# EasyEDA schematic SCH_t4_MFA_LCD_2021-12-15.json
TITLE: LCD Driver; REV: 1.0; Date: 2021-07-19; Sheet: 1/1; Drawn By: TCA965
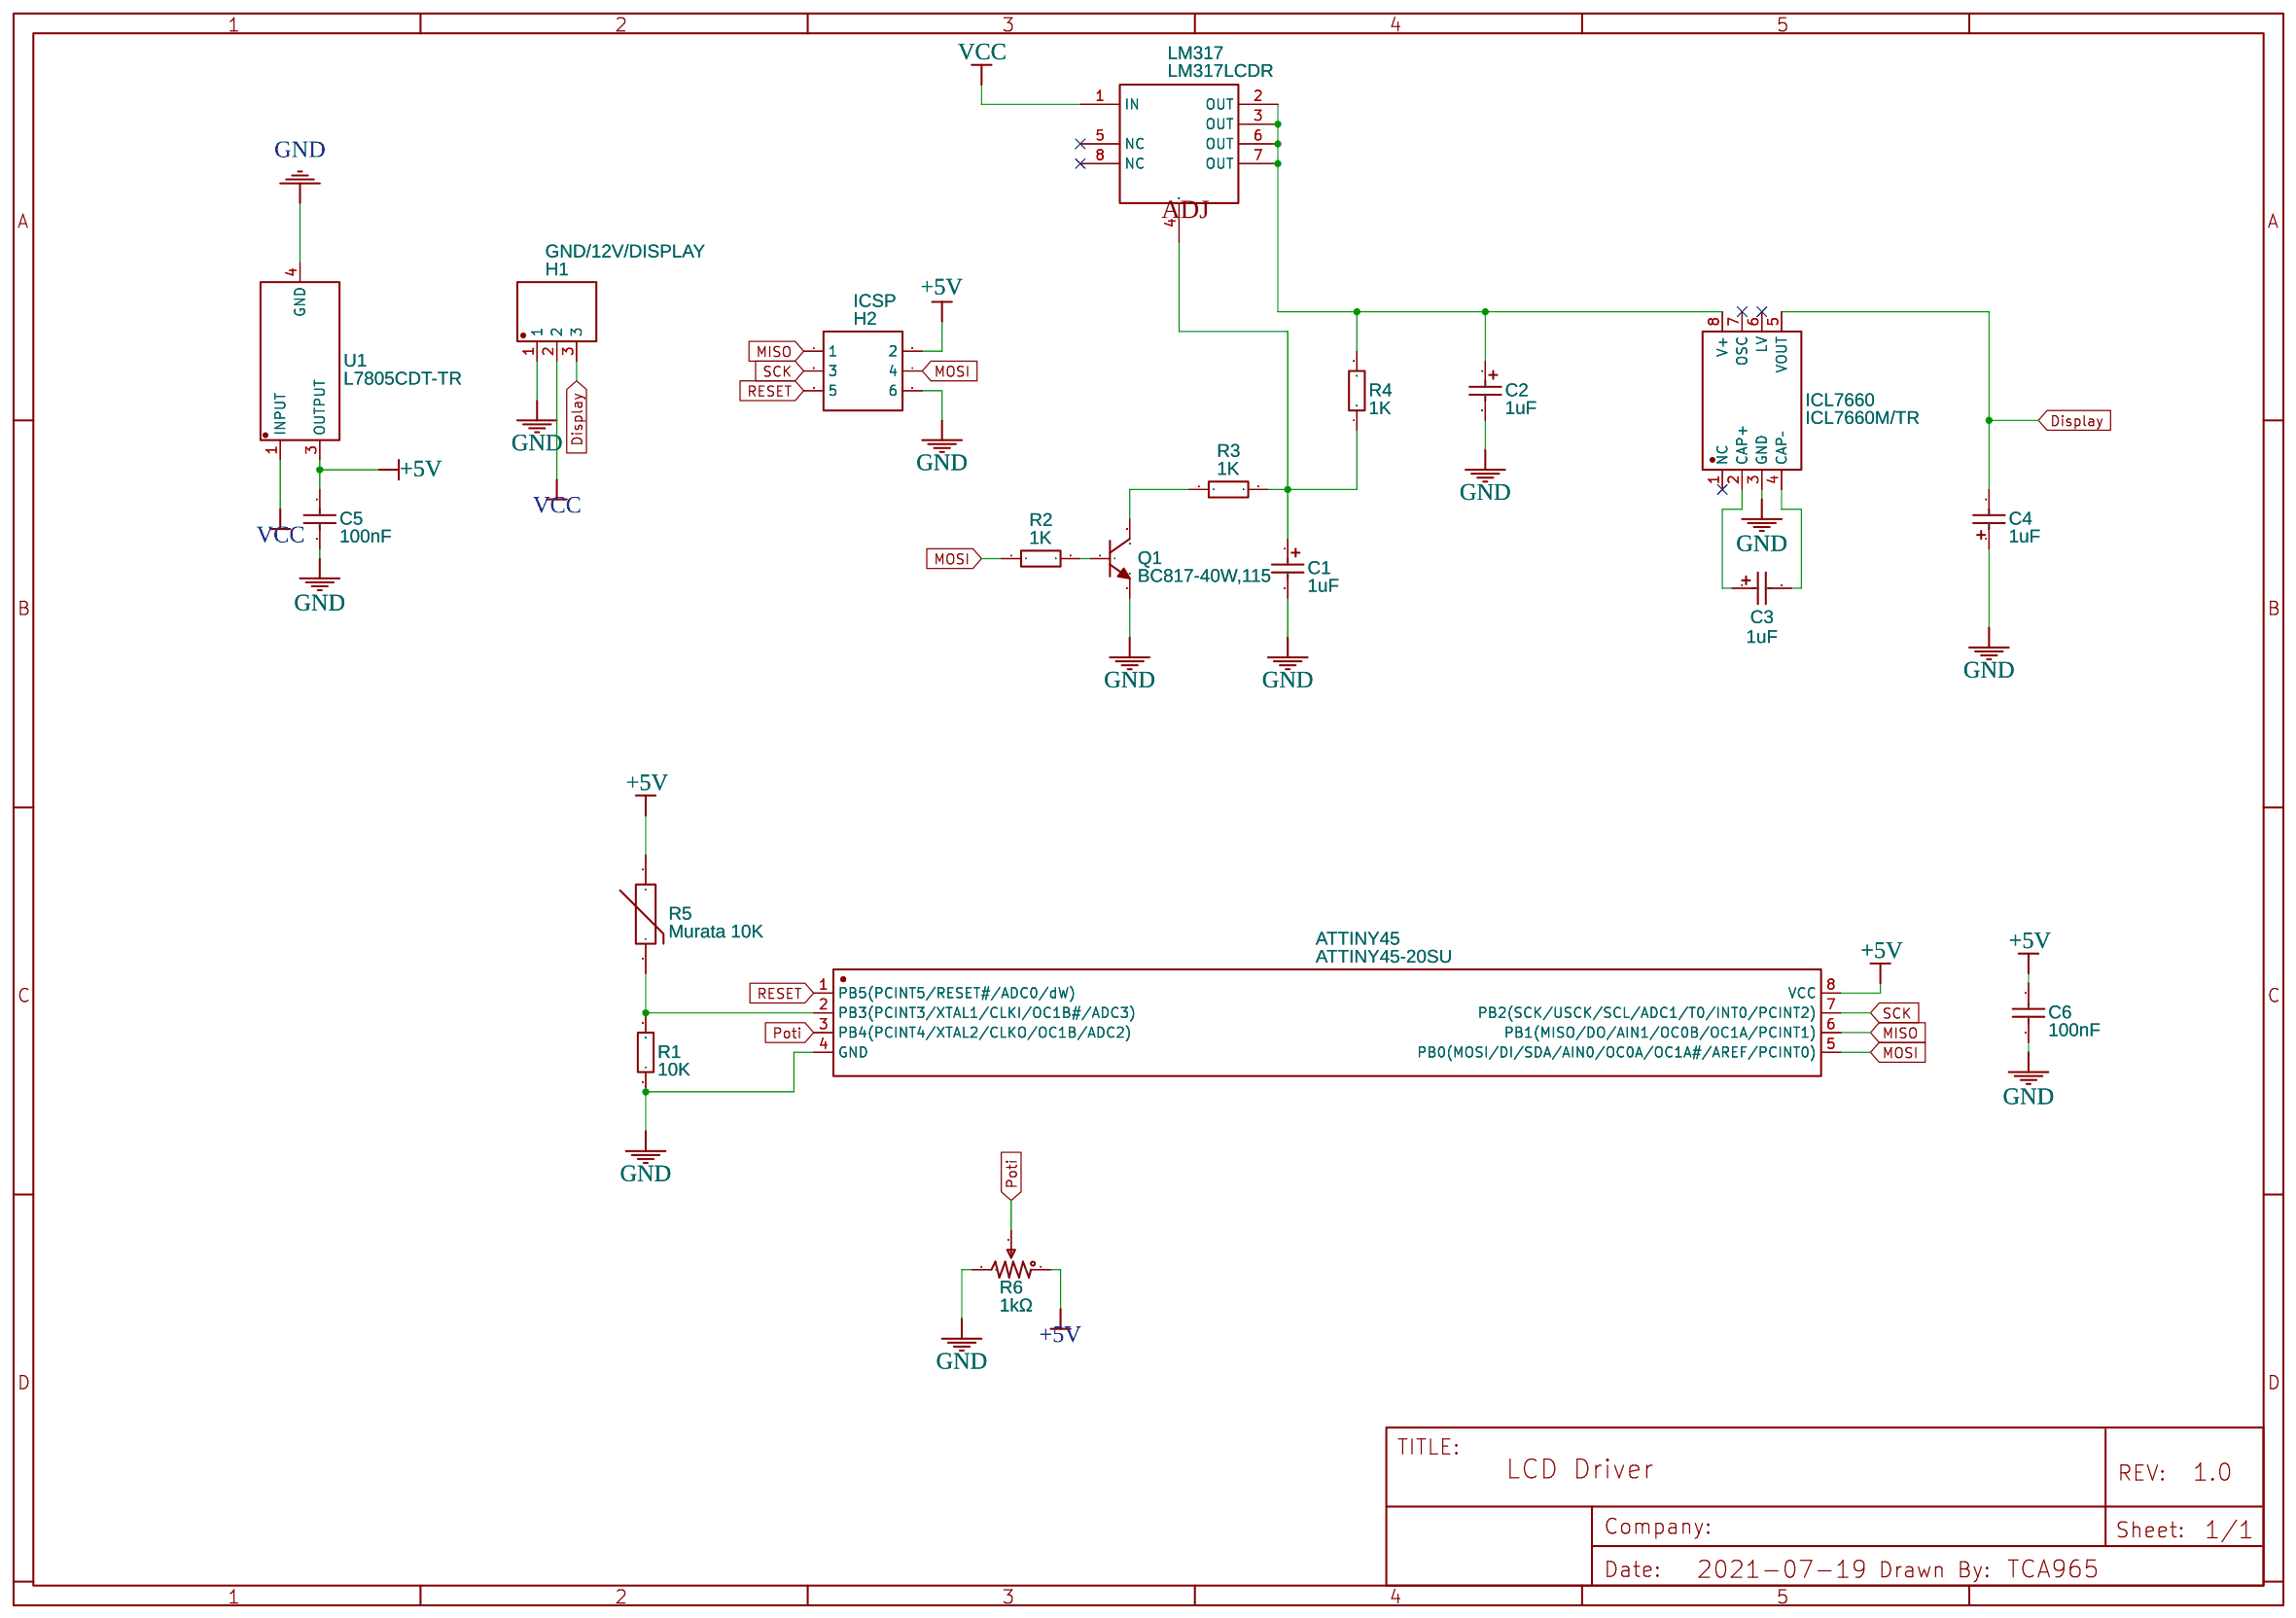
[diagram p0: schematic sheet]

## Parts
ATTINY45  ATTINY45-20SU  [SOIC-8_L5.3-W5.3-P1.27-LS8.0-BL]
C1  1uF  [CAP-SMD_L6.0-W3.2-R-RD]
C2  1uF  [CAP-SMD_L6.0-W3.2-R-RD]
C3  1uF  [CAP-SMD_L6.0-W3.2-R-RD]
C4  1uF  [CAP-SMD_L6.0-W3.2-R-RD]
C5  100nF  [C1206]
C6  100nF  [C1206]
GND/12V/DISPLAY  H1  [HDR-TH_3P-P2.54-V-M-1]
ICL7660  ICL7660M/TR  [SOP-8_L4.9-W3.9-P1.27-LS6.0-BL]
ICSP  H2  [HDR-TH_6P-P2.54-V-M-R2-C3-S2.54-1]
LM317  LM317LCDR  [SOIC-8_L4.9-W3.9-P1.27-LS6.0-BL]
Q1  BC817-40W,115  [SOT-323-3_L2.2-W1.3-P1.30-LS2.2-BR]
R1  10K  [R0805]
R2  1K  [R0805]
R3  1K  [R0805]
R4  1K  [R0805]
R5  Murata 10K  [RES-TH_L4.0-W2.0-P2.54-D0.7]
R6  1kΩ  [RES-ADJ-SMD_3314G-1-103E]
U1  L7805CDT-TR  [DPAK_L6.5-W6.0-P2.29-LS9.9-TL]

## Library data of the parts
ATTINY45 = ATTINY45-20SU: Supplier: LCSC; Manufacturer: MICROCHIP; Contributor: LCSC; Supplier Part: C62689; JLCPCB Part Class: Extended Part
C1-C4 = 293D105X9050C2TE3: Supplier: LCSC; Manufacturer: VISHAY; Supplier Part: C130371; JLCPCB Part Class: Extended Part
C5 C6 = C1206N104J050T: Supplier: LCSC; Manufacturer: HEC; Supplier Part: C105970; JLCPCB Part Class: Extended Part
GND/12V/DISPLAY = 210S-1*3P L=11.6MMGold-plated black: Supplier: LCSC; Manufacturer: Ckmtw; Contributor: LCSC; Supplier Part: C124376; JLCPCB Part Class: Extended Part
ICL7660 = ICL7660M/TR: Supplier: LCSC; Supplier Part: C356724; Manufacturer: HGSEMI; Contributor: LCSC; JLCPCB Part Class: Extended Part
ICSP = Header-Male-2.54_2x3: Supplier: LCSC; Manufacturer: BOOMELE; Supplier Part: C65114; JLCPCB Part Class: Extended Part
LM317 = LM317LCDR: Supplier: LCSC; Manufacturer: TI; Supplier Part: C105219; JLCPCB Part Class: Extended Part
Q1 = BC817-40W,115: Supplier: LCSC; Manufacturer: Nexperia; Supplier Part: C75565; JLCPCB Part Class: Extended Part
R1 = TR0805B10KP0525: Supplier: LCSC; Supplier Part: C188360; Manufacturer: Ever Ohms Tech; Contributor: LCSC; JLCPCB Part Class: Extended Part
R2-R4 = 0805WAD1001T5E: Supplier: LCSC; Supplier Part: C169072; Manufacturer: Uniroyal Elec; Contributor: LCSC; JLCPCB Part Class: Extended Part
R5 = NXRT15XH103FA1B030: Supplier: LCSC; Supplier Part: C152559; Manufacturer: Murata Electronics; Contributor: LCSC; JLCPCB Part Class: Extended Part
R6 = 3314G-1-503E: Supplier: LCSC; Supplier Part: C719184; Manufacturer: BOURNS; JLCPCB Part Class: Extended Part; Contributor: LCSC
U1 = L7805CDT-TR: Supplier: LCSC; Supplier Part: C310413; Manufacturer: STMicroelectronics; Contributor: LCSC; JLCPCB Part Class: Extended Part

## Nets
+5V: ATTINY45.8(VCC) C5.2 C6.2 ICSP.2 R5.2 R6.1 U1.3(OUTPUT)
GND: ATTINY45.4(GND) C1.2 C2.2 C4.1 C5.1 C6.1 GND/12V/DISPLAY.1 ICL7660.3(GND) ICSP.6 Q1.2 R1.1 R6.3 U1.4(GND)
VCC: GND/12V/DISPLAY.2 LM317.1(IN) U1.1(INPUT)
Display: C4.2 GND/12V/DISPLAY.3 ICL7660.5(VOUT)
MISO: ATTINY45.6(PB1(MISO/DO/AIN1/OC0B/OC1A/PCINT1)) ICSP.1
MOSI: ATTINY45.5(PB0(MOSI/DI/SDA/AIN0/OC0A/OC1A#/AREF/PCINT0)) ICSP.4 R2.1
Poti: ATTINY45.3(PB4(PCINT4/XTAL2/CLKO/OC1B/ADC2)) R6.2
RESET: ATTINY45.1(PB5(PCINT5/RESET#/ADC0/dW)) ICSP.5
SCK: ATTINY45.7(PB2(SCK/USCK/SCL/ADC1/T0/INT0/PCINT2)) ICSP.3
Net-(ATTINY45-2): ATTINY45.2(PB3(PCINT3/XTAL1/CLKI/OC1B#/ADC3)) R1.2 R5.1
Net-(C1-1): C1.1 LM317.4(ADJ) R3.2 R4.1
Net-(C2-1): C2.1 ICL7660.8(V+) LM317.2(OUT) LM317.3(OUT) LM317.6(OUT) LM317.7(OUT) R4.2
Net-(C3-1): C3.1 ICL7660.2(CAP+)
Net-(C3-2): C3.2 ICL7660.4(CAP–)
Net-(Q1-1): Q1.1 R2.2
Net-(Q1-3): Q1.3 R3.1

Not connected (* = marked no-connect by the designer): ICL7660 1(NC)* 6(LV)* 7(OSC)*; LM317 5(NC)* 8(NC)*
